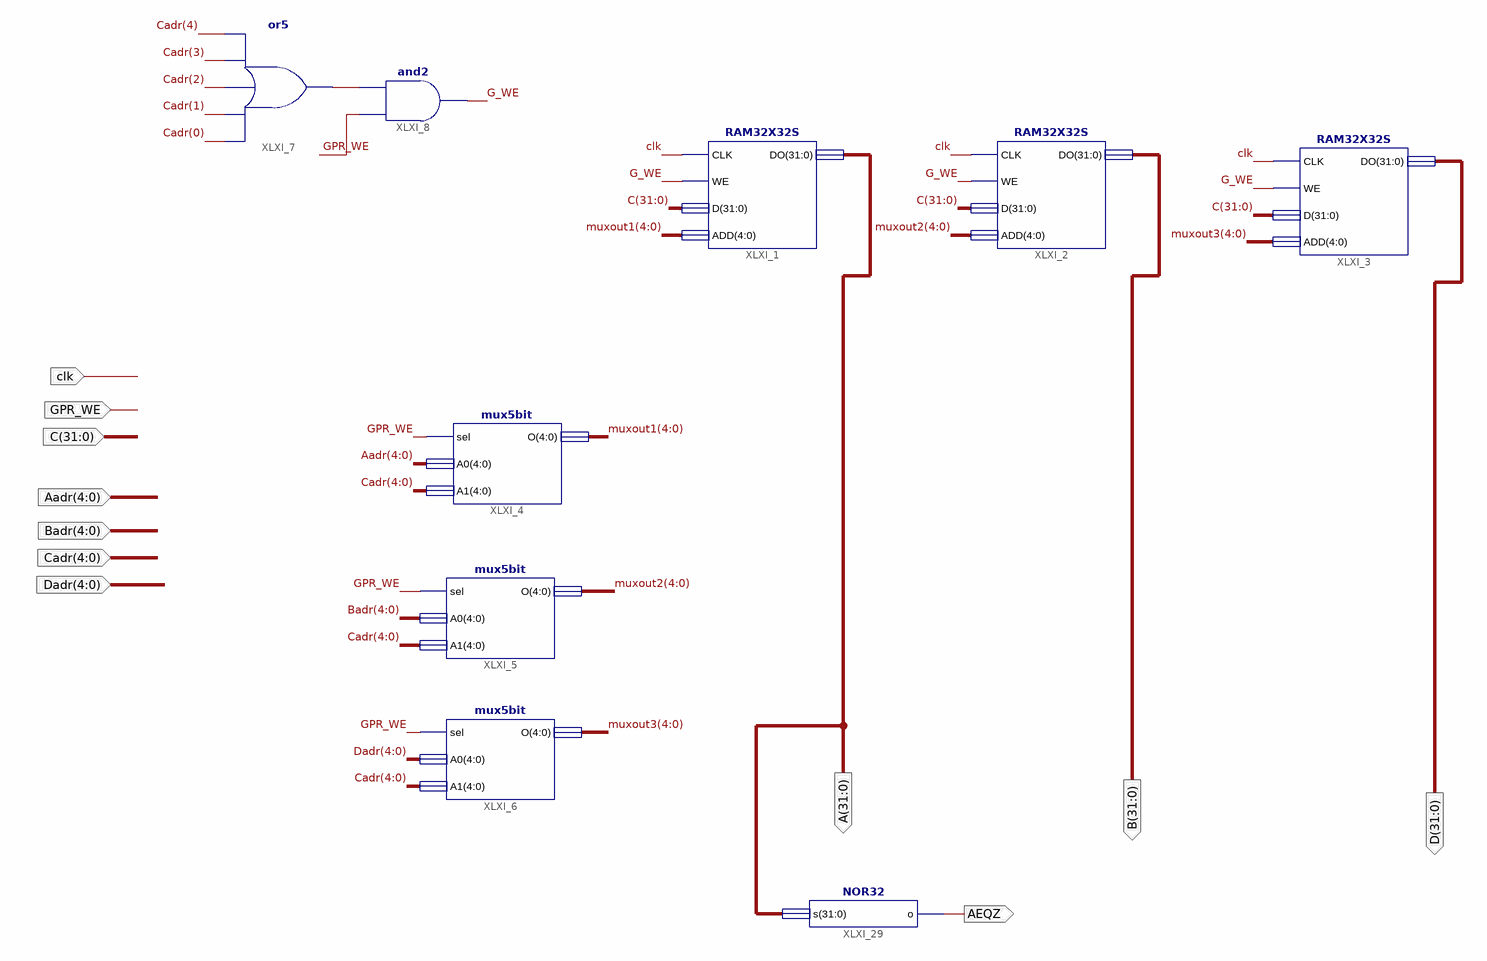
[diagram p0: schematic sheet 1]
// Xilinx ISE schematic myGPR.sch (spartan2) as structural Verilog: 9 symbols, 11 ports
module myGPR (
  input  GPR_WE,
  input  [31:0] C,
  input  clk,
  input  [4:0] Aadr,
  input  [4:0] Badr,
  input  [4:0] Cadr,
  input  [4:0] Dadr,
  output [31:0] D,
  output [31:0] A,
  output [31:0] B,
  output AEQZ
);

  wire G_WE, XLXN_1;
  wire [4:0] muxout1, muxout2, muxout3;

  mux5bit XLXI_4 (.sel(GPR_WE), .A0(Aadr), .A1(Cadr), .O(muxout1));
  mux5bit XLXI_5 (.sel(GPR_WE), .A0(Badr), .A1(Cadr), .O(muxout2));
  mux5bit XLXI_6 (.sel(GPR_WE), .A0(Dadr), .A1(Cadr), .O(muxout3));
  or XLXI_7 (XLXN_1, Cadr[0], Cadr[1], Cadr[2], Cadr[3], Cadr[4]);
  and XLXI_8 (G_WE, GPR_WE, XLXN_1);
  RAM32X32S XLXI_3 (.CLK(clk), .WE(G_WE), .D(C), .ADD(muxout3), .DO(D));
  RAM32X32S XLXI_2 (.CLK(clk), .WE(G_WE), .D(C), .ADD(muxout2), .DO(B));
  RAM32X32S XLXI_1 (.CLK(clk), .WE(G_WE), .D(C), .ADD(muxout1), .DO(A));
  NOR32 XLXI_29 (.s(A), .o(AEQZ));
endmodule
